# EAGLE board LT3579_SEPIC_Test_Bench (EAGLE 9.6.2)
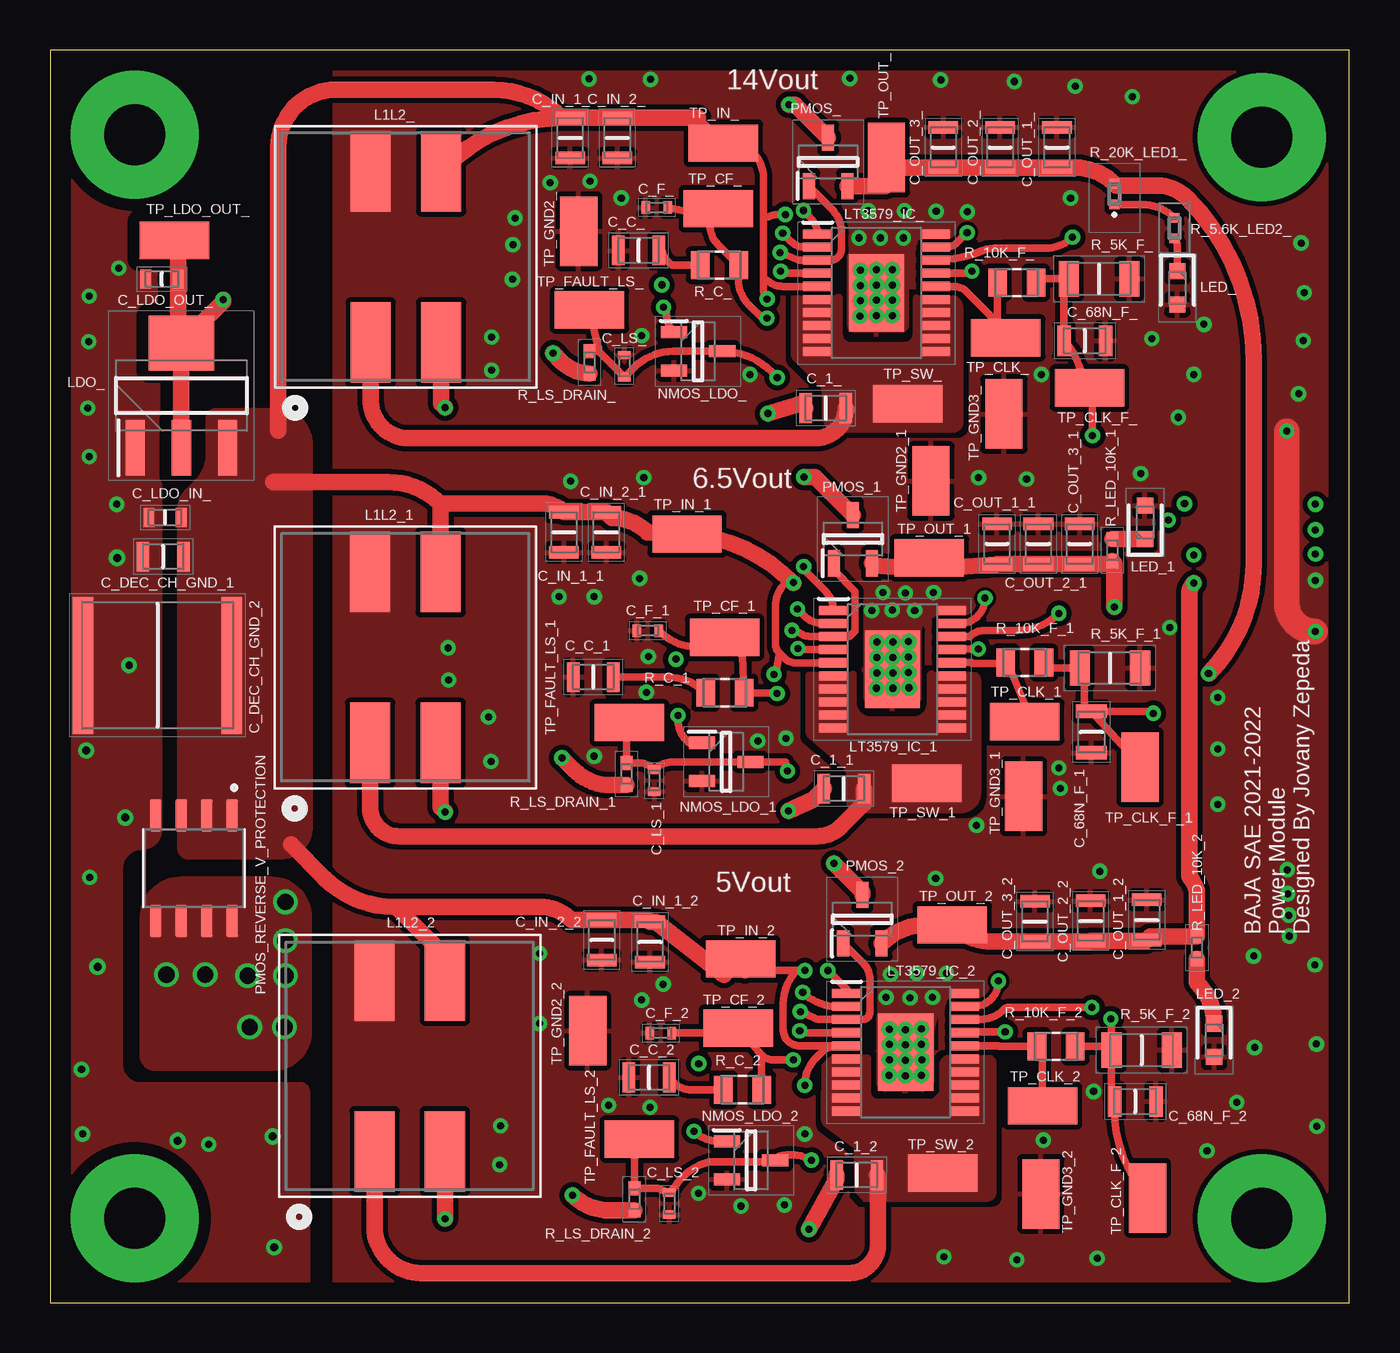
[diagram p5: board, top side]
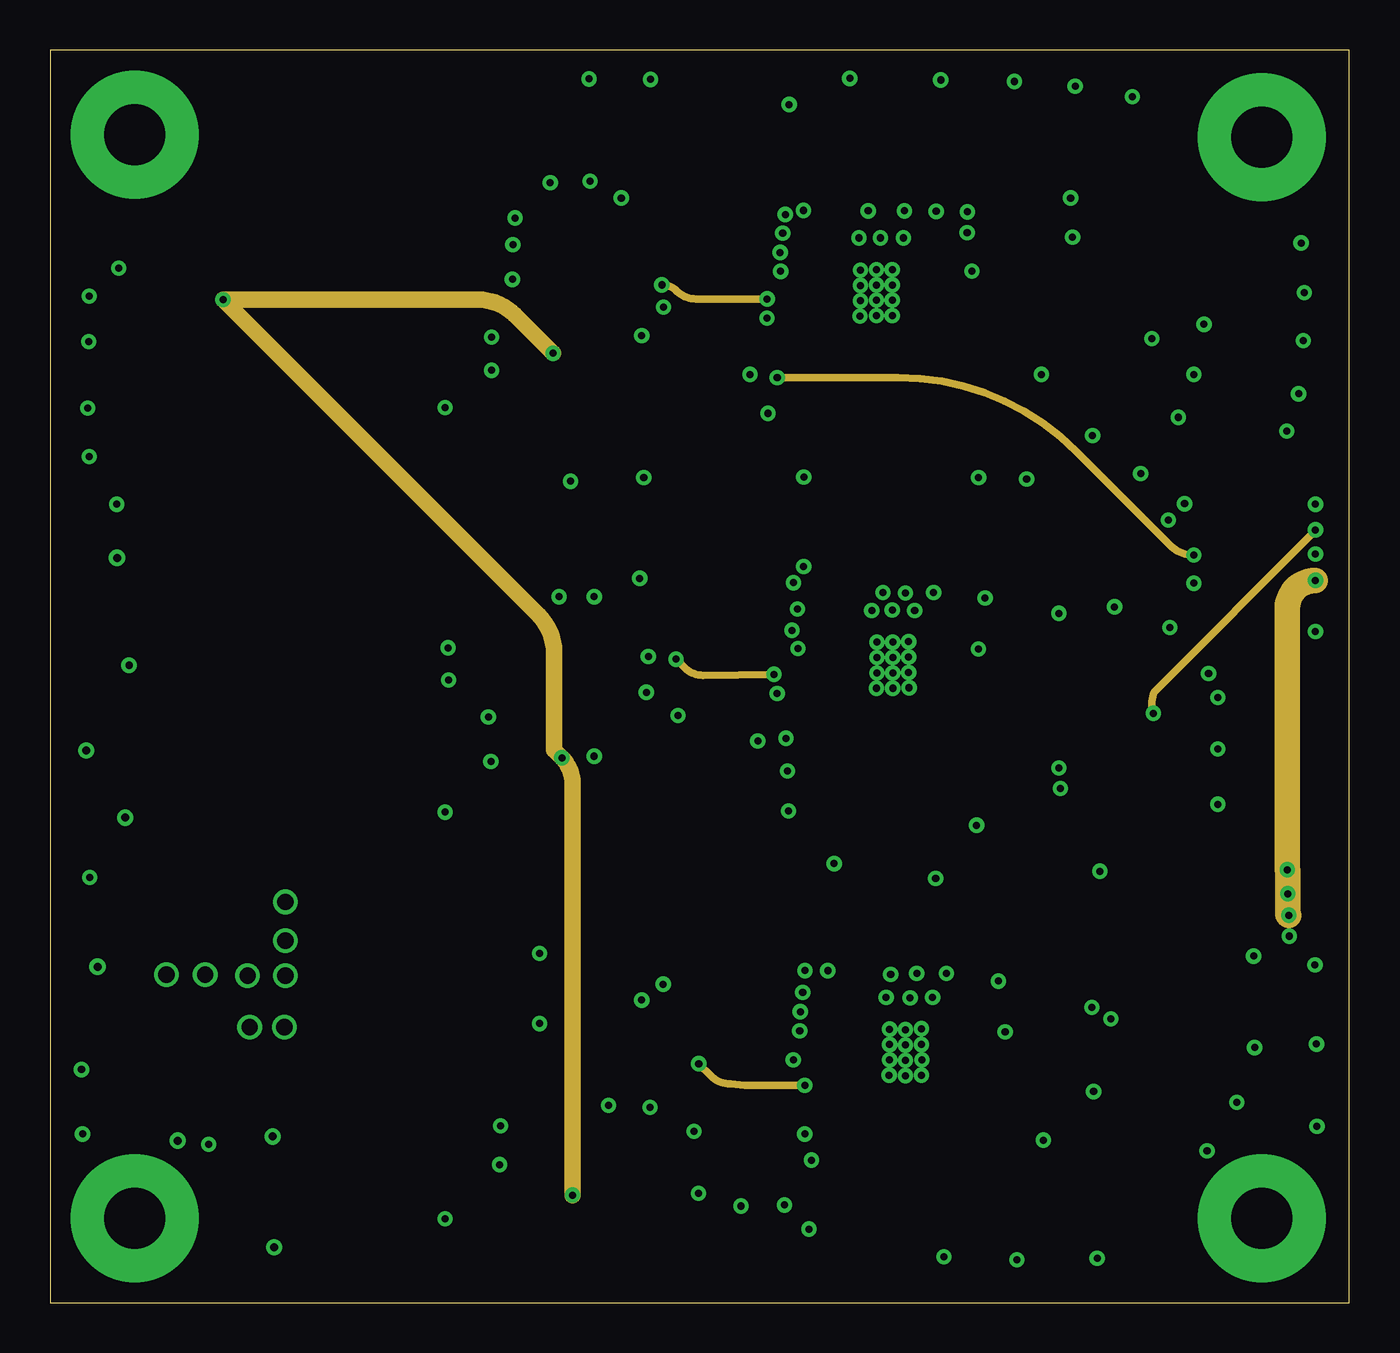
[diagram p6: board, inner layer Route2]
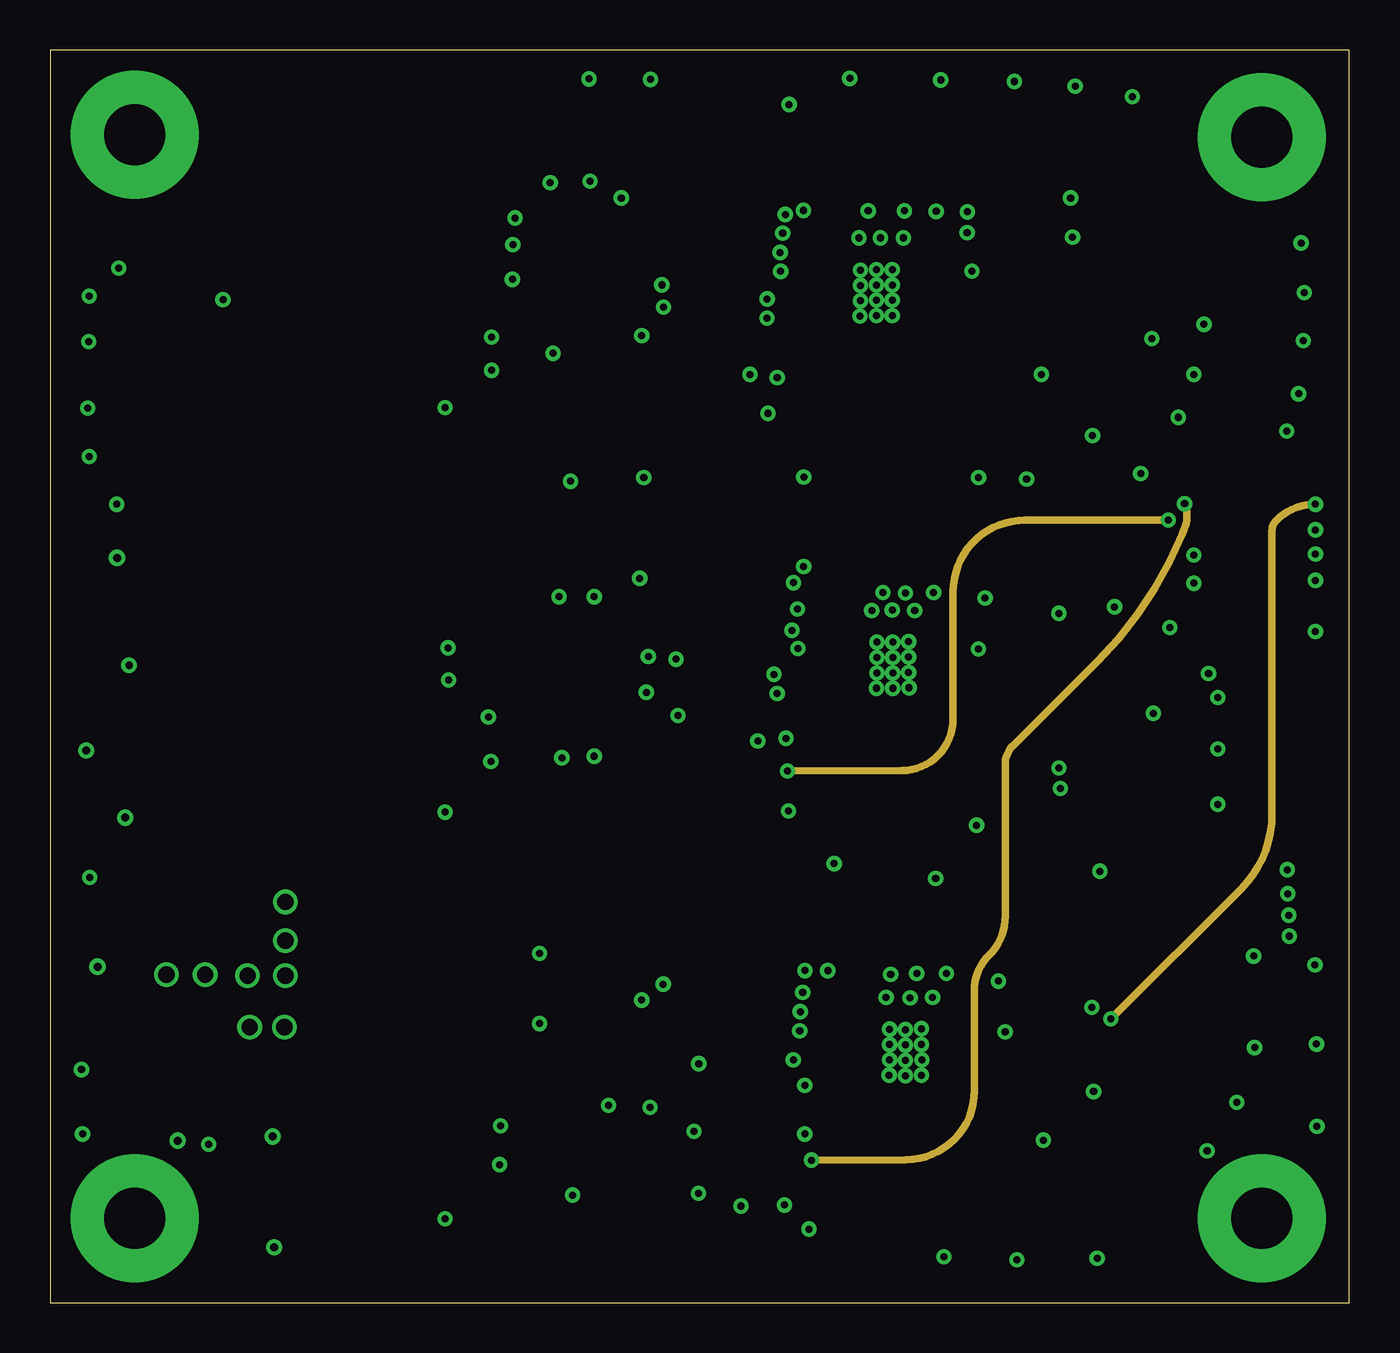
[diagram p7: board, inner layer Route15]
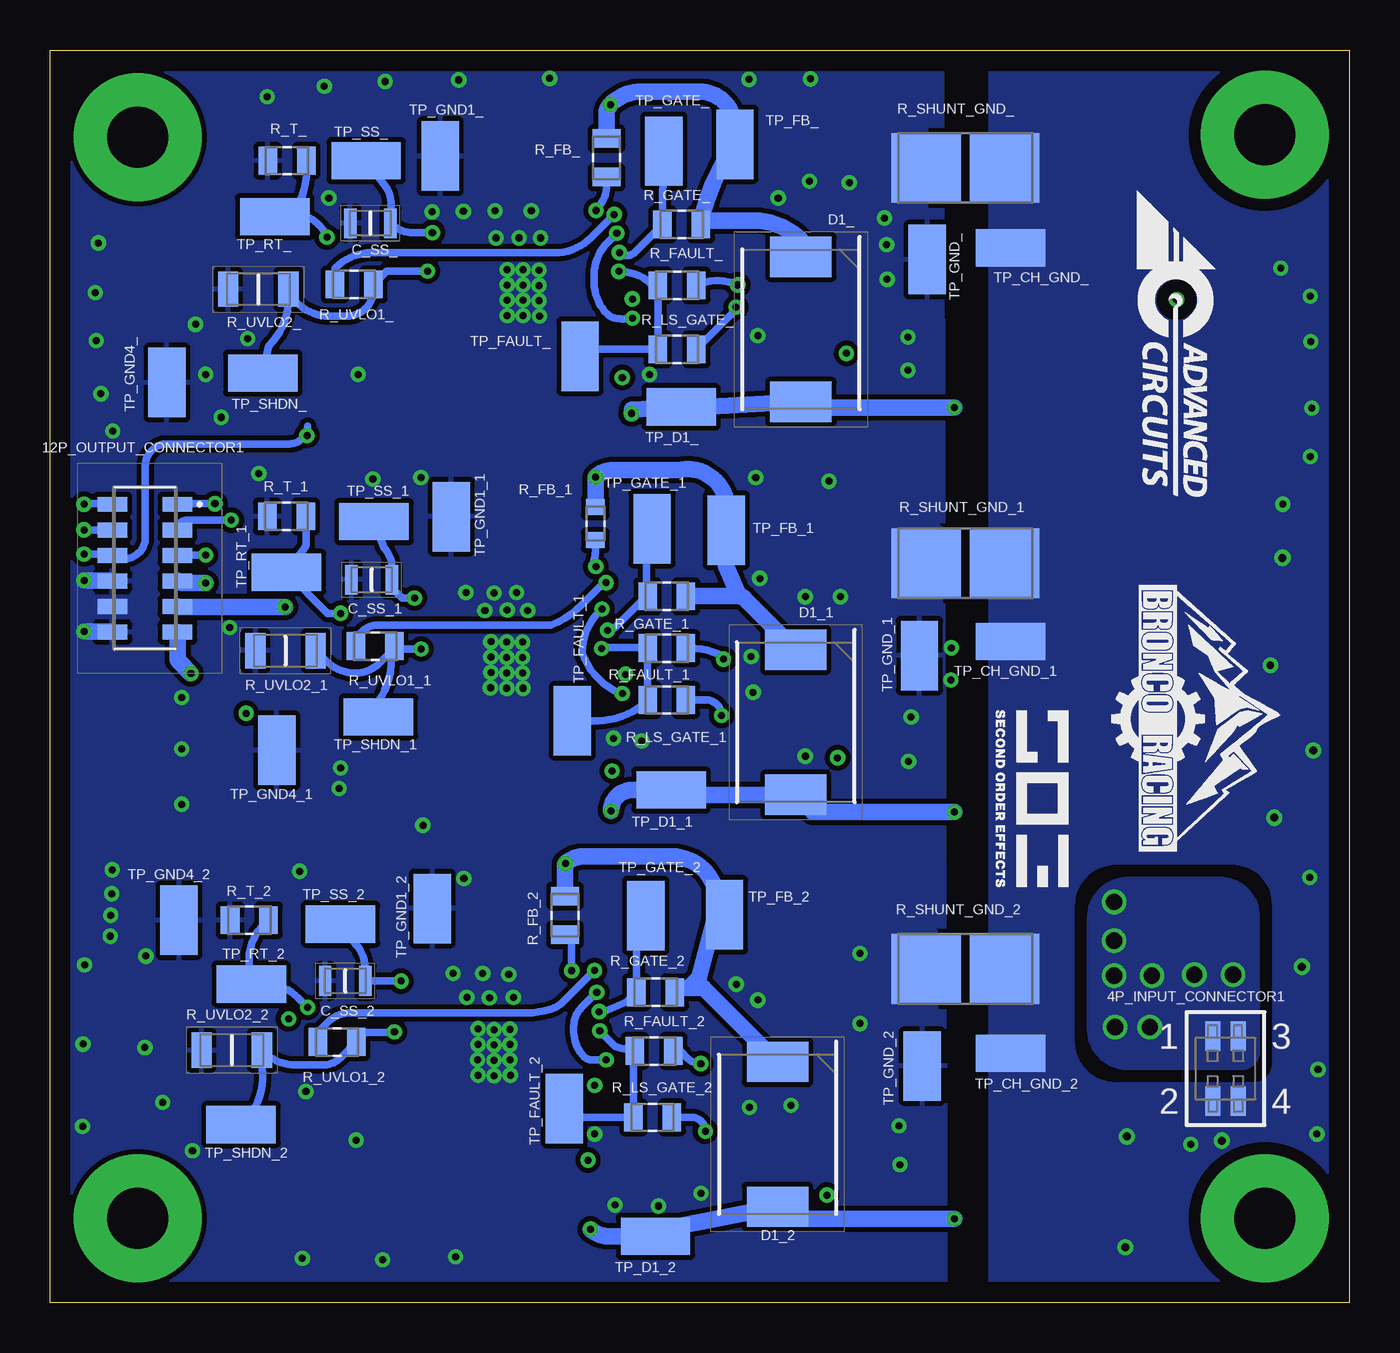
[diagram p8: board, bottom side, seen from below]

Size 64.54 x 62.23 mm. Coordinates in mm from the lower left corner, seen from the top.
Outline: 0,62.23 0,0 64.54,0 64.54,62.23 0,62.23
Copper layers (1+2*15+16): Top 0.035mm / dielectric 0.2mm / Route2 0.0175mm / dielectric 1.065mm / Route15 0.0175mm / dielectric 0.2mm / Bottom 0.035mm
Design rules "default *": minimum track width 15mil, minimum drill 0.35mm, track to track 6mil, track to pad 6mil, pad to pad 6mil, via to via 6mil, smd to smd 6mil, copper to edge 40mil, drill to drill 6mil, minimum pad ring 10mil, minimum via ring 8mil, stop-mask expansion 4mil, vias tented up to drill 40mil, thermal gap 10mil
Net classes: 1 PWR_Connector: width 3.29 mm; 2 PWR_Vin_Vout: width 0.816 mm; 3 Signal: width 0.381 mm; 4 PWR_Vin: width 0.046 mm

## Footprints (pad centres in the part's own frame; a part is rotated, then mirrored left to right if it is on the bottom)
SAMTEC-CLP-102-02-X-D = smd 0.74 x 1.47: 1 -0.635,1.613; 2 -0.635,-1.613; 3 0.635,1.613; 4 0.635,-1.613
CLP-106-02-XXX = smd 0.74 x 1.47: 1 3.175,-1.615; 2 3.175,1.615; 3 1.905,-1.615; 4 1.905,1.615; 5 0.635,-1.615; 6 0.635,1.615; 7 -0.635,-1.615; 8 -0.635,1.615; 9 -1.905,-1.615; 10 -1.905,1.615; 11 -3.175,-1.615; 12 -3.175,1.615
CAPC2012X145N = smd 0.62 x 1.47: 1 -1,0; 2 1,0
CAPC2013X150N = smd 0.67 x 1.52: 1 -1.03,0; 2 1.03,0
CAPC2012X100N = smd 0.62 x 1.47: 1 -1,0; 2 1,0
CAPC7563X250N = smd 1.01 x 6.81: 1 -3.7,0; 2 3.7,0
CAPC1005X55N = smd 0.42 x 0.62: 1 -0.55,0; 2 0.55,0
CAPC1608X90N = smd 0.54 x 0.94: 1 -0.8,0; 2 0.8,0
DIOM7958X256N = smd 2 x 3.05: 1 -3.6,0; 2 3.6,0
MSD1278T-822MLXX = smd 2 x 4: 1 1.75,4.25; 2 -1.75,4.25; 3 -1.75,-4.25; 4 1.75,-4.25
SOT230P700X180-4N = smd 2.75 x 0.95: 1 -2.6,2.3; 2 -2.6,0; 3 -2.6,-2.3 | smd 2.75 x 3.25: 4 2.6,0
APT1608CGCK = smd 0.8 x 0.8: 1 -0.825,0; 2 0.825,0
SOP65P640X120-21N = smd 1.45 x 0.45: 1 -2.925,2.925; 2 -2.925,2.275; 3 -2.925,1.625; 4 -2.925,0.975; 5 -2.925,0.325; 6 -2.925,-0.325; 7 -2.925,-0.975; 8 -2.925,-1.625; 9 -2.925,-2.275; 10 -2.925,-2.925; 11 2.925,-2.925; 12 2.925,-2.275; 13 2.925,-1.625; 14 2.925,-0.975; 15 2.925,-0.325; 16 2.925,0.325; 17 2.925,0.975; 18 2.925,1.625; 19 2.925,2.275; 20 2.925,2.925 | smd 2.74 x 3.86: 21 0,0
SOT95P280X100-3N = smd 1.3 x 0.6: 1 -1.2,0.95; 2 -1.2,-0.95; 3 1.2,0
SOIC127P600X170-8N = smd 1.58 x 0.59: 1 -2.625,1.905; 2 -2.625,0.635; 3 -2.625,-0.635; 4 -2.625,-1.905; 5 2.625,-1.905; 6 2.625,-0.635; 7 2.625,0.635; 8 2.625,1.905
ERA2AED122X = smd 0.475 x 0.5: 1 -0.512,0; 2 0.512,0
RESC3116X65N = smd 1 x 1.75: 1 -1.5,0; 2 1.5,0
RESC2012X60N = smd 0.92 x 1.38: 1 -0.955,0; 2 0.955,0
ERJ2R_(0402) = smd 0.475 x 0.5: 1 -0.512,0; 2 0.512,0
RESC1608X55N = smd 0.79 x 0.93: 1 -0.82,0; 2 0.82,0
RESC1005X37N = smd 0.7 x 0.6: 1 -0.55,0; 2 0.55,0
RESC6432X55N = smd 3.45 x 3.46: 1 -1.956,0; 2 1.956,0
S1751-46R_ = smd 3.45 x 1.85: 1 0,0
THROUGH_HOLE = drill 3.048 pad 6.35: THROUGH_HOLE 0,0

## Placement (x,y rotation side)
4P_INPUT_CONNECTOR1  SAMTEC-CLP-102-02-X-DJ  [SAMTEC-CLP-102-02-X-D]  6.15,11.63 0 bottom
12P_OUTPUT_CONNECTOR1  CLP-106-02-F-D  [CLP-106-02-XXX]  59.84,36.49 90 bottom
C_1_  CGA4J1X7R1E475K125AE  [CAPC2012X145N]  38.53,44.45 180 top
C_1_1  CGA4J1X7R1E475K125AE  [CAPC2012X145N]  39.43,25.54 180 top
C_1_2  CGA4J1X7R1E475K125AE  [CAPC2012X145N]  40.08,6.35 180 top
C_68N_F_  CEU4J2X7R1H683K125AE  [CAPC2013X150N]  51.4,47.8 0 top
C_68N_F_1  CEU4J2X7R1H683K125AE  [CAPC2013X150N]  51.73,28.35 270 top
C_68N_F_2  CEU4J2X7R1H683K125AE  [CAPC2013X150N]  53.91,10 0 top
C_C_  CGA4F4C0G2W222J085AE  [CAPC2012X100N]  29.23,52.28 180 top
C_C_1  CGA4F4C0G2W222J085AE  [CAPC2012X100N]  26.98,31.09 180 top
C_C_2  CGA4F4C0G2W222J085AE  [CAPC2012X100N]  29.75,11.2 180 top
C_DEC_CH_GND_1  CGA4F4C0G2W222J085AE  [CAPC2012X100N]  5.61,37.07 0 top
C_DEC_CH_GND_2  CGADN3X7R1E476M230LE  [CAPC7563X250N]  5.33,31.67 0 top
C_F_  CGA2B2C0G1H470J050BA  [CAPC1005X55N]  30.14,54.41 180 top
C_F_1  CGA2B2C0G1H470J050BA  [CAPC1005X55N]  29.69,33.39 180 top
C_F_2  CGA2B2C0G1H470J050BA  [CAPC1005X55N]  30.33,13.4 180 top
C_IN_1_  CGA4J1X7R1E475K125AE  [CAPC2012X145N]  25.83,57.87 270 top
C_IN_1_1  CGA4J1X7R1E475K125AE  [CAPC2012X145N]  25.52,38.28 270 top
C_IN_1_2  CGA4J1X7R1E475K125AE  [CAPC2012X145N]  29.8,17.92 270 top
C_IN_2_  CGA4J1X7R1E475K125AE  [CAPC2012X145N]  28.17,57.87 270 top
C_IN_2_1  CGA4J1X7R1E475K125AE  [CAPC2012X145N]  27.63,38.28 270 top
C_IN_2_2  CGA4J1X7R1E475K125AE  [CAPC2012X145N]  27.4,18.02 270 top
C_LDO_IN_  CGA3E1X7R1V105K080AC  [CAPC1608X90N]  5.7,39.02 180 top
C_LDO_OUT_  JMK107BB7475KA-T  [CAPC1608X90N]  5.55,50.87 180 top
C_LS_  CGA2B2C0G1H102J050BE  [CAPC1005X55N]  28.53,46.53 90 top
C_LS_1  CGA2B2C0G1H102J050BE  [CAPC1005X55N]  30.02,25.94 270 top
C_LS_2  CGA2B2C0G1H102J050BE  [CAPC1005X55N]  30.76,4.92 270 top
C_OUT_1_  CGA4J1X7R1E475K125AE  [CAPC2012X145N]  50.02,57.4 90 top
C_OUT_1_1  CGA4J1X7R1E475K125AE  [CAPC2012X145N]  47.04,37.7 90 top
C_OUT_1_2  CGA4J1X7R1E475K125AE  [CAPC2012X145N]  54.48,19.02 90 top
C_OUT_2_  CGA4J1X7R1E475K125AE  [CAPC2012X145N]  47.19,57.4 90 top
C_OUT_2_1  CGA4J1X7R1E475K125AE  [CAPC2012X145N]  49.1,37.7 90 top
C_OUT_2_2  CGA4J1X7R1E475K125AE  [CAPC2012X145N]  51.69,18.96 90 top
C_OUT_3_  CGA4J1X7R1E475K125AE  [CAPC2012X145N]  44.37,57.4 90 top
C_OUT_3_1  CGA4J1X7R1E475K125AE  [CAPC2012X145N]  51.15,37.7 90 top
C_OUT_3_2  CGA4J1X7R1E475K125AE  [CAPC2012X145N]  48.93,18.94 90 top
C_SS_  CGA4J2X8R1E224K125AE  [CAPC2012X145N]  48.63,53.64 180 bottom
C_SS_1  CGA4J2X8R1E224K125AE  [CAPC2012X145N]  48.57,35.92 180 bottom
C_SS_2  CGA4J2X8R1E224K125AE  [CAPC2012X145N]  49.88,15.99 180 bottom
D1_  MBRS330T3G  [DIOM7958X256N]  27.25,48.36 270 bottom
D1_1  MBRS330T3G  [DIOM7958X256N]  27.5,28.84 270 bottom
D1_2  MBRS330T3G  [DIOM7958X256N]  28.4,8.36 270 bottom
L1L2_  MSD1278T-XXXXX__  [MSD1278T-822MLXX]  17.67,51.96 180 top
L1L2_1  MSD1278T-XXXXX__  [MSD1278T-822MLXX]  17.64,32.06 180 top
L1L2_2  MSD1278T-XXXXX__  [MSD1278T-822MLXX]  17.86,11.76 180 top
LDO_  LDL1117S33R  [SOT230P700X180-4N]  6.51,45.08 90 top
LED_  APTD1608LCGCK  [APT1608CGCK]  56,50.43 270 top
LED_1  APTD1608LCGCK  [APT1608CGCK]  54.4,38.77 90 top
LED_2  APTD1608LCGCK  [APT1608CGCK]  57.83,13.04 270 top
LT3579_IC_  LT3579EFE#PBF  [SOP65P640X120-21N]  41.05,50.17 0 top
LT3579_IC_1  LT3579EFE#PBF  [SOP65P640X120-21N]  41.84,31.47 0 top
LT3579_IC_2  LT3579EFE#PBF  [SOP65P640X120-21N]  42.5,12.44 0 top
NMOS_LDO_  RSR025N03HZGTL  [SOT95P280X100-3N]  32.19,47.27 0 top
NMOS_LDO_1  RSR025N03HZGTL  [SOT95P280X100-3N]  33.59,26.87 0 top
NMOS_LDO_2  RSR025N03HZGTL  [SOT95P280X100-3N]  34.82,7.07 0 top
PMOS_  RQ5E050ATTCL  [SOT95P280X100-3N]  38.65,56.68 90 top
PMOS_1  RQ5E050ATTCL  [SOT95P280X100-3N]  39.88,37.94 90 top
PMOS_2  RQ5E050ATTCL  [SOT95P280X100-3N]  40.35,19.05 90 top
PMOS_REVERSE_V_PROTECTION  DMP3015LSSQ-13  [SOIC127P600X170-8N]  7.14,21.59 270 top
R_5.6K_LED2_  ERA-2ARB562X  [ERA2AED122X]  55.86,53.39 270 top
R_5K_F_  RT1206BRD075KL  [RESC3116X65N]  52.11,50.87 0 top
R_5K_F_1  RT1206BRD075KL  [RESC3116X65N]  52.65,31.53 0 top
R_5K_F_2  RT1206BRD075KL  [RESC3116X65N]  54.23,12.55 0 top
R_10K_F_  AC0805DR-0710KL  [RESC2012X60N]  48.02,50.68 0 top
R_10K_F_1  AC0805DR-0710KL  [RESC2012X60N]  48.42,31.81 0 top
R_10K_F_2  AC0805DR-0710KL  [RESC2012X60N]  49.98,12.73 0 top
R_20K_LED1_  ERJ-2RKF2002X  [ERJ2R_(0402)]  52.88,55.08 90 top
R_C_  AC0805JR-0712KL  [RESC2012X60N]  33.24,51.56 180 top
R_C_1  AC0805JR-0712KL  [RESC2012X60N]  33.52,30.3 180 top
R_C_2  AC0805JR-0712KL  [RESC2012X60N]  34.4,10.58 180 top
R_FAULT_  AT0805FRE07100KL  [RESC2012X60N]  33.39,50.55 0 bottom
R_FAULT_1  AT0805FRE07100KL  [RESC2012X60N]  33.91,32.53 0 bottom
R_FAULT_2  AT0805FRE07100KL  [RESC2012X60N]  34.54,12.51 0 bottom
R_FB_  AC0805FR-07150KL  [RESC2012X60N]  36.9,56.89 270 bottom
R_FB_1  AC0603FR-0764K9L  [RESC1608X55N]  37.46,38.71 270 bottom
R_FB_2  AC0805FR-0745K3L  [RESC2012X60N]  38.96,19.25 270 bottom
R_GATE_  AC0805FR-0710KL  [RESC2012X60N]  33.17,53.58 180 bottom
R_GATE_1  AC0805FR-0710KL  [RESC2012X60N]  33.91,35.1 180 bottom
R_GATE_2  AC0805FR-0710KL  [RESC2012X60N]  34.46,15.42 180 bottom
R_LED_10K_1  MCS0402MD1002DE000  [RESC1005X37N]  52.78,37.39 90 top
R_LED_10K_2  MCS0402MD1002DE000  [RESC1005X37N]  56.98,17.64 270 top
R_LS_DRAIN_  MCS0402MD1002DE000  [RESC1005X37N]  26.8,46.72 270 top
R_LS_DRAIN_1  MCS0402MD1002DE000  [RESC1005X37N]  28.63,26.27 270 top
R_LS_DRAIN_2  MCS0402MD1002DE000  [RESC1005X37N]  29.02,5.14 270 top
R_LS_GATE_  AT0805FRE07100KL  [RESC2012X60N]  33.4,47.37 0 bottom
R_LS_GATE_1  AT0805FRE07100KL  [RESC2012X60N]  33.91,29.95 0 bottom
R_LS_GATE_2  AT0805FRE07100KL  [RESC2012X60N]  34.61,9.21 0 bottom
R_SHUNT_GND_  GMR100HTCFAR100  [RESC6432X55N]  19.07,56.38 180 bottom
R_SHUNT_GND_1  GMR100HTCFAR100  [RESC6432X55N]  19.07,36.73 180 bottom
R_SHUNT_GND_2  GMR100HTCFAR100  [RESC6432X55N]  19.07,16.58 180 bottom
R_T_  AC0805FR-07124KL  [RESC2012X60N]  52.78,56.75 180 bottom
R_T_1  AC0805FR-07124KL  [RESC2012X60N]  52.81,39.07 180 bottom
R_T_2  AC0805FR-07124KL  [RESC2012X60N]  54.65,19.01 180 bottom
R_UVLO1_  AC0805FR-0730KL  [RESC2012X60N]  49.44,50.6 180 bottom
R_UVLO1_1  AC0805FR-0730KL  [RESC2012X60N]  48.39,32.62 180 bottom
R_UVLO1_2  AC0805FR-0730KL  [RESC2012X60N]  50.29,12.95 180 bottom
R_UVLO2_  RT1206BRD075KL  [RESC3116X65N]  54.21,50.36 0 bottom
R_UVLO2_1  RT1206BRD075KL  [RESC3116X65N]  52.85,32.4 0 bottom
R_UVLO2_2  RT1206BRD075KL  [RESC3116X65N]  55.53,12.55 0 bottom
TP_CF_  S1751-46R  [S1751-46R_]  33.19,54.36 180 top
TP_CF_1  S1751-46R  [S1751-46R_]  33.51,33.07 180 top
TP_CF_2  S1751-46R  [S1751-46R_]  34.19,13.64 180 top
TP_CH_GND_  S1751-46R  [S1751-46R_]  16.83,52.41 0 bottom
TP_CH_GND_1  S1751-46R  [S1751-46R_]  16.83,32.85 0 bottom
TP_CH_GND_2  S1751-46R  [S1751-46R_]  16.83,12.39 0 bottom
TP_CLK_  S1751-46R  [S1751-46R_]  47.47,47.94 180 top
TP_CLK_1  S1751-46R  [S1751-46R_]  48.43,28.87 0 top
TP_CLK_2  S1751-46R  [S1751-46R_]  49.3,9.78 180 top
TP_CLK_F_  S1751-46R  [S1751-46R_]  51.64,45.45 0 top
TP_CLK_F_1  S1751-46R  [S1751-46R_]  54.15,26.61 270 top
TP_CLK_F_2  S1751-46R  [S1751-46R_]  54.53,5.21 270 top
TP_D1_  S1751-46R  [S1751-46R_]  33.19,44.51 0 bottom
TP_D1_1  S1751-46R  [S1751-46R_]  33.69,25.47 0 bottom
TP_D1_2  S1751-46R  [S1751-46R_]  34.47,3.3 0 bottom
TP_FAULT_  S1751-46R  [S1751-46R_]  38.22,47.03 270 bottom
TP_FAULT_1  S1751-46R  [S1751-46R_]  38.6,28.92 270 bottom
TP_FAULT_2  S1751-46R  [S1751-46R_]  39,9.65 90 bottom
TP_FAULT_LS_  S1751-46R  [S1751-46R_]  26.79,49.33 0 top
TP_FAULT_LS_1  S1751-46R  [S1751-46R_]  28.77,28.82 180 top
TP_FAULT_LS_2  S1751-46R  [S1751-46R_]  29.27,8.12 180 top
TP_FB_  S1751-46R  [S1751-46R_]  30.52,57.56 270 bottom
TP_FB_1  S1751-46R  [S1751-46R_]  30.96,38.39 270 bottom
TP_FB_2  S1751-46R  [S1751-46R_]  31.04,19.27 90 bottom
TP_GATE_  S1751-46R  [S1751-46R_]  34.06,57.22 90 bottom
TP_GATE_1  S1751-46R  [S1751-46R_]  34.65,38.46 270 bottom
TP_GATE_2  S1751-46R  [S1751-46R_]  34.96,19.23 90 bottom
TP_GND1_  S1751-46R  [S1751-46R_]  45.16,56.98 270 bottom
TP_GND1_1  S1751-46R  [S1751-46R_]  44.62,39.06 90 bottom
TP_GND1_2  S1751-46R  [S1751-46R_]  45.55,19.58 90 bottom
TP_GND2_  S1751-46R  [S1751-46R_]  26.26,53.24 90 top
TP_GND2_1  S1751-46R  [S1751-46R_]  43.76,40.83 90 top
TP_GND2_2  S1751-46R  [S1751-46R_]  26.7,13.52 270 top
TP_GND3_  S1751-46R  [S1751-46R_]  47.38,44.16 90 top
TP_GND3_1  S1751-46R  [S1751-46R_]  48.36,25.16 90 top
TP_GND3_2  S1751-46R  [S1751-46R_]  49.22,5.4 90 top
TP_GND4_  S1751-46R  [S1751-46R_]  58.75,45.73 90 bottom
TP_GND4_1  S1751-46R  [S1751-46R_]  53.29,27.44 90 bottom
TP_GND4_2  S1751-46R  [S1751-46R_]  58.15,19.01 90 bottom
TP_GND_  S1751-46R  [S1751-46R_]  20.97,51.84 270 bottom
TP_GND_1  S1751-46R  [S1751-46R_]  21.36,32.15 270 bottom
TP_GND_2  S1751-46R  [S1751-46R_]  21.22,11.76 270 bottom
TP_IN_  S1751-46R  [S1751-46R_]  33.45,57.61 0 top
TP_IN_1  S1751-46R  [S1751-46R_]  31.64,38.19 0 top
TP_IN_2  S1751-46R  [S1751-46R_]  34.31,17.09 0 top
TP_LDO_OUT_  S1751-46R  [S1751-46R_]  6.16,52.78 180 top
TP_OUT_  S1751-46R  [S1751-46R_]  41.55,56.9 270 top
TP_OUT_1  S1751-46R  [S1751-46R_]  43.67,37.02 0 top
TP_OUT_2  S1751-46R  [S1751-46R_]  44.82,18.77 180 top
TP_RT_  S1751-46R  [S1751-46R_]  53.39,53.96 0 bottom
TP_RT_1  S1751-46R  [S1751-46R_]  52.81,36.29 180 bottom
TP_RT_2  S1751-46R  [S1751-46R_]  54.55,15.83 0 bottom
TP_SHDN_  S1751-46R  [S1751-46R_]  53.99,46.19 0 bottom
TP_SHDN_1  S1751-46R  [S1751-46R_]  48.24,29.1 0 bottom
TP_SHDN_2  S1751-46R  [S1751-46R_]  55.07,8.85 0 bottom
TP_SS_  S1751-46R  [S1751-46R_]  48.85,56.75 180 bottom
TP_SS_1  S1751-46R  [S1751-46R_]  48.46,38.82 180 bottom
TP_SS_2  S1751-46R  [S1751-46R_]  50.12,18.81 180 bottom
TP_SW_  S1751-46R  [S1751-46R_]  42.6,44.67 0 top
TP_SW_1  S1751-46R  [S1751-46R_]  43.54,25.81 180 top
TP_SW_2  S1751-46R  [S1751-46R_]  44.34,6.43 180 top
U$1  THROUGH_HOLE_  [THROUGH_HOLE]  4.19,4.19 0 top
U$2  THROUGH_HOLE_  [THROUGH_HOLE]  60.2,4.19 0 top
U$3  THROUGH_HOLE_  [THROUGH_HOLE]  60.2,57.91 0 top
U$4  THROUGH_HOLE_  [THROUGH_HOLE]  4.19,58.04 180 top

## Tracks (layer width: path | path; a pad name or v marks a point on that pad's centre or on a via)
CH_GND  (via drill 0.35, 0.4)
  other vias: 11.13,2.75 11.05,8.25 6.33,8.05 2.35,16.69 3.73,24.1 1.78,27.43 3.31,37.01 3.91,31.67 1.96,21.13 3.3,39.67 1.93,42.04 1.85,44.45 1.91,47.75 3.4,51.41 1.93,50.01 1.55,11.58 1.6,8.38 7.87,7.87
  pour Bottom (isolate 0.61, rank 2, no thermals): 17.88,62.36 -0.25,62.36 -0.25,-0.13 17.88,-0.13
  pour Top (isolate 0.61, no thermals): 12.88,-0.3 -0.23,-0.3 -0.23,62.38 12.98,62.38 12.98,45.83 arc-90 12.03,44.88 7.65,44.88 arc90 6.96,44.19 6.96,42.61 arc-90 6.06,41.71 arc90 5.54,41.18 5.54,23.52 arc-90 4.55,22.53 arc90 3.58,21.56 3.58,11.83 arc90 4.49,10.92 12.45,10.92 arc-90 12.88,10.49
  pour Bottom (no thermals): 17.04,58.83 17.04,54.25 16.89,54.1 14.83,54.1 14.66,54.28 14.66,58.42 14.88,58.65 15.06,58.83
  pour Bottom (no thermals): 17.14,38.94 17.14,34.77 16.97,34.59 15.21,34.59 15.11,34.7 15.04,34.77 15.04,38.81 15.34,39.12 16.92,39.12 16.99,39.12 17.14,38.96
  pour Bottom (no thermals): 16.74,18.52 16.99,18.26 16.99,14.63 16.87,14.5 15.06,14.5 14.88,14.68 14.88,18.41 14.99,18.52
CLK_
  Top 0.381: R_10K_F_.1 47.07,48.7 46.92,48.85 | TP_CLK_.1 46.92,48.85 | LT3579_IC_.16 44.89,50.5 arc-45 45.53,50.23 46.92,48.85
CLK_1
  Top 0.381: TP_CLK_1.1 48.42,29.73 47.64,31.63 R_10K_F_1.1 47.41,31.76 45.82,31.76 45.78,31.8 LT3579_IC_1.16
CLK_2
  Top 0.381: LT3579_IC_2.16 47.05,12.77 arc-45 47.15,12.73 47.74,12.73 47.75,12.73 R_10K_F_2.1 49.3,12.46 TP_CLK_2.1
CLK_FILTER_OUT_  (via drill 0.35)
  Top 0.381: v51.79,43.09 51.79,45.31 TP_CLK_F_.1 51.3,45.44 arc45 C_68N_F_.1 50.37,50.63 R_5K_F_.1 49.17,50.87 R_10K_F_.2
  Bottom 0.381: v62.87,37.2 61.52,37.2 12P_OUTPUT_CONNECTOR1.6 61.45,36.96 60.89,36.96 arc-90 59.82,38.03 59.82,41.6 arc90 58.74,42.67 52.66,42.67 arc-90 51.76,43.57 v51.79,43.09
CLK_FILTER_OUT_1  (via drill 0.35)
  Top 0.381: R_10K_F_1.2 49.65,31.53 R_5K_F_1.1 51.38,31.31 51.38,29.31 C_68N_F_1.1 | C_68N_F_1.1 54.01,26.88 TP_CLK_F_1.1 | v54.81,29.29 54.72,29.38 C_68N_F_1.1
  Route2 0.381: v62.87,38.4 62.87,38.36 54.86,30.35 arc45 v54.81,29.29
  Bottom 0.381: v62.87,38.4 12P_OUTPUT_CONNECTOR1.4 | 12P_OUTPUT_CONNECTOR1.4
CLK_FILTER_OUT_2  (via drill 0.35)
  Top 0.381: R_5K_F_2.1 52.55,12.73 R_10K_F_2.2 | R_5K_F_2.1 52.73,10.14 C_68N_F_2.1 52.88,9.63 arc41 TP_CLK_F_2.1 | R_5K_F_2.1 52.73,14.03 arc45 v52.7,14.1
  Route15 0.381: v52.7,14.1 59.18,20.57 arc45 60.71,24.26 60.71,38.36 arc-45 60.91,38.87 arc-45 v62.87,39.67
  Bottom 0.381: v62.87,39.67 62.84,39.7 61.48,39.7 12P_OUTPUT_CONNECTOR1.2
FAULT_  (via drill 0.35)
  Top 0.381: LT3579_IC_.4 36.39,51.15 v36.29,51.25
  Bottom 0.381: TP_FAULT_.1 37.82,47.03 37.48,47.37 R_LS_GATE_.1 R_FAULT_.1 34.6,50.55 arc-45 v36.29,51.25
FAULT_1  (via drill 0.35)
  Top 0.381: LT3579_IC_1.4 37.21,32.45 v37.16,32.5
  Bottom 0.381: v37.16,32.5 37.11,32.55 34.89,32.55 R_FAULT_1.1 R_LS_GATE_1.1 arc45 37.36,28.92 TP_FAULT_1.1
FAULT_2  (via drill 0.35)
  Top 0.381: LT3579_IC_2.4 37.32,13.42 v37.24,13.5
  Bottom 0.381: v37.24,13.5 36.48,12.74 arc-22 35.66,12.58 35.6,12.51 R_FAULT_2.1 35.57,12.43 R_LS_GATE_2.1 38.56,9.21 TP_FAULT_2.1
FAULT_LS_OUT_  (via drill 0.35)
  Top 0.381: TP_FAULT_LS_.1 27.23,47.39 26.72,47.35 R_LS_DRAIN_.1 27.24,47.27 C_LS_.1 29.01,46.46 arc-45 30.96,47.27 NMOS_LDO_.3 arc-45 35.84,46.26 v36.12,45.97
  Route2 0.381: v36.12,45.97 42.11,45.97 arc-45 50.99,42.3 55.7,37.58 arc45 56.75,37.15 v56.82,37.15
  Bottom 0.381: v56.82,37.15 58.21,37.15 12P_OUTPUT_CONNECTOR1.5
FAULT_LS_OUT_1  (via drill 0.35)
  Top 0.381: TP_FAULT_LS_1.1 28.63,28.53 R_LS_DRAIN_1.1 29.22,26.82 arc-45 C_LS_1.1 arc-45 30.93,26.87 NMOS_LDO_1.3 36.53,26.87 v36.63,26.42
  Route15 0.381: v36.63,26.42 42.3,26.44 arc90 44.86,29 44.86,35.31 arc-90 48.43,38.88 v55.55,38.88
  Bottom 0.381: 12P_OUTPUT_CONNECTOR1.3 arc90 57.74,38.88 v55.55,38.88
FAULT_LS_OUT_2  (via drill 0.35)
  Top 0.381: TP_FAULT_LS_2.1 29.02,7.35 R_LS_DRAIN_2.1 30.07,5.69 arc-45 30.59,5.47 C_LS_2.1 31.03,5.75 arc-45 32.73,7 35.94,7 NMOS_LDO_2.3 36.21,7.27 arc-45 v37.82,7.08
  Route15 0.381: v56.36,39.7 arc-45 56.36,38.46 56.25,38.19 arc-22 52.02,31.86 47.84,27.69 arc45 47.45,26.73 47.45,19.67 47.45,19.2 arc-45 46.64,17.25 arc45 45.92,15.51 45.92,10.53 arc-90 42.51,7.1 v37.82,7.08
  Bottom 0.381: v56.36,39.7 58.2,39.7 12P_OUTPUT_CONNECTOR1.1
FB_  (via drill 0.35)
  Top 0.381: v37.43,54.27 37.61,54.09 arc-23 38.12,53.32 LT3579_IC_.1
  Bottom 0.381: R_FB_.2 36.9,55.55 arc45 v37.43,54.27
FB_1  (via drill 0.35)
  Top 0.381: v37.43,36.57 37.43,36.45 38.52,35.35 arc-45 LT3579_IC_1.1
  Bottom 0.381: R_FB_1.2 37.46,37.31 arc23 37.56,36.8 37.33,36.57 v37.43,36.57
FB_2  (via drill 0.35)
  Top 0.381: LT3579_IC_2.1 39.58,15.56 v38.63,16.5
  Bottom 0.381: R_FB_2.2 38.63,18.21 v38.63,16.5
GATE_  (via drill 0.35)
  Top 0.381: PMOS_.1 38.8,54.38 arc-45 39.32,53.12 39.32,52.37 arc-90 38.75,51.8 LT3579_IC_.3 37.17,51.8 36.28,52.17 arc-45 v36.27,52.18
  Bottom 0.381: v36.27,52.18 arc-90 35.51,52.18 R_GATE_.2 34.09,57.18 TP_GATE_.1
GATE_1  (via drill 0.35)
  Top 0.381: v36.85,33.41 37.06,33.41 arc45 37.81,33.1 LT3579_IC_1.3 39.7,33.1 39.99,33.38 39.99,35.34 38.93,36.39 PMOS_1.1
  Bottom 0.381: R_GATE_1.2 34.86,35.17 34.92,35.11 | v36.85,33.41 36.84,33.4 arc-45 36.49,33.54 34.92,35.11 | TP_GATE_1.1 34.92,38.19 34.92,35.11
GATE_2  (via drill 0.35)
  Top 0.381: PMOS_2.1 40.4,16.86 arc-45 40.72,16.08 40.72,14.42 arc-90 40.37,14.07 LT3579_IC_2.3 38.4,14.07 arc-45 37.45,14.46 v37.26,14.46
  Bottom 0.381: TP_GATE_2.1 35.41,19.03 R_GATE_2.2 35.9,14.94 37.05,14.46 v37.26,14.46
GND  (via drill 0.35)
  Top 1.27: v61.44,43.31 61.44,34.77 arc90 v62.87,33.35
  Route2 1.27: v62.87,35.89 arc90 61.47,34.49 v61.47,21.51 61.49,21.49 v61.49,20.32 61.49,19.3 v61.54,19.25
  Bottom 0.816: v62.87,33.35 v62.87,33.34 61.48,33.34 12P_OUTPUT_CONNECTOR1.12 | v62.87,35.89 61.45,35.89 12P_OUTPUT_CONNECTOR1.8
  other vias: 22.96,50.85 29.82,60.78 28.37,54.89 44.25,60.76 50.93,60.45 57.33,48.62 54.74,47.9 26.77,60.81 23.09,53.9 22.99,52.58 21.92,47.98 21.92,46.33 29.39,48.06 34.77,46.13 40.18,52.91 41.25,52.91 42.39,52.91 39.73,60.83 47.9,60.68 53.77,59.92 49.25,46.13 56.06,43.99 56.82,46.13 62.03,45.16 62.26,47.8 62.31,50.19 62.15,52.65 24.84,55.65 26.82,55.73 40.64,54.25 42.44,54.25 44.02,54.23 45.57,54.2 50.7,54.89 22.38,8.79 29.39,15.04 30.45,15.82 44.4,2.29 52.02,2.21 57.48,7.54 49.35,8.08 59.84,12.67 59.79,17.22 52.15,21.44 43.99,21.08 24.31,13.87 24.31,17.35 22.33,6.86 27.74,9.8 29.79,9.7 32.21,5.44 34.32,4.8 36.47,4.85 37.49,8.38 48.03,2.13 51.84,10.49 58.95,9.96 62.94,8.76 62.92,12.85 62.84,16.79 41.53,15.16 42.72,15.14 43.84,15.16 61.57,18.21 41.76,16.31 43.05,16.36 44.53,16.36 27.03,35.08 21.77,29.11 29.62,30.33 35.15,27.91 48.51,40.92 54.18,41.2 50.19,25.55 46.02,23.72 25.86,40.82 29.49,41 46.13,41 25.27,35.08 29.29,35.99 19.76,32.54 19.79,30.94 21.89,26.9 27.03,27.15 29.72,32.11 36.55,28.04 40.82,34.39 41.83,34.42 42.95,34.39 55.63,33.55 58.01,30.07 58.01,27.51 58.01,24.77 50.11,26.57 41.38,35.28 42.49,35.26 43.89,35.28 41.07,32.82 42.65,32.84 41.86,32.82 41.07,32.05 41.07,31.29 41.05,30.53 41.86,32.05 41.86,31.29 41.86,30.53 42.65,32.08 42.65,31.32 42.67,30.56 40.26,51.31 41.83,51.33 41.05,51.33 40.26,50.55 40.26,49.78 40.23,49.02 41.05,50.57 41.05,49.81 41.05,49.05 41.83,50.57 41.83,49.81 41.83,49.05 41.71,13.59 43.28,13.61 42.49,13.56 41.71,12.83 41.71,12.06 41.68,11.3 42.49,12.8 42.49,12.04 42.49,11.28 43.28,12.83 43.31,12.06 43.28,11.3
  pour Bottom (isolate 0.25): 20.21,62.37 20.05,-0.48 65.31,-0.48 65.48,62.37
  pour Top (isolate 0.25, rank 2): 14.07,62.38 65.7,62.38 65.13,-0.58 14.07,-0.58
  pour Top (no thermals): 15.27,58.42 14.76,58.42 14.66,58.32 14.66,54 14.78,53.87 17.27,53.87 17.32,53.92 17.32,58.24 17.2,58.37 17.14,58.42
  pour Bottom (no thermals): 21.11,58.85 21.11,54.31 21.23,54.18 23.22,54.18 23.29,54.25 23.29,58.67 23.24,58.72 23.09,58.88 23.06,58.85
  pour Top (no thermals): 39.62,48.63 39.62,53.9 arc-90 40.49,54.76 47.37,54.76 arc-90 47.45,54.69 47.45,53.12 arc-90 47.18,52.86 43.35,52.86 arc45 43.23,52.81 42.61,52.19 42.61,48.55 arc-90 42.29,48.23 40.02,48.23 arc-90
  pour Top (no thermals): 16.03,18.34 14.86,18.34 14.63,18.11 14.63,13.74 14.99,13.39 17.45,13.39 17.75,13.69 17.75,17.68 17.5,17.93 17.09,18.34
  pour Bottom (no thermals): 20.47,18.44 20.6,18.57 22.94,18.57 23.09,18.41 23.09,14.5 23.01,14.43 20.6,14.43 20.47,14.55
  pour Top (no thermals): 43.87,11.3 43.87,11.07 arc-90 43.31,10.52 41.53,10.52 arc-90 41.1,10.95 41.1,16.35 arc-90 41.69,16.94 47.21,16.94 arc-90 47.68,16.47 47.68,15.49 arc-90 47.29,15.11 44.74,15.11 arc45 44.68,15.09 44.61,15.02 arc45 43.87,13.22
  pour Top (no thermals): 15.21,39.07 14.53,38.38 14.53,37.72 14.53,34.14 14.78,33.88 17.12,33.88 17.27,34.04 17.45,34.21 17.45,38.51 16.89,39.07
  pour Bottom (no thermals): 60.38,35.1 60.4,35.13 62.56,35.13 62.64,35.05 62.64,34.01 60.5,34.01 60.38,34.14
  pour Bottom (no thermals): 20.75,39.01 20.24,38.51 20.24,34.59 20.37,34.47 23.22,34.47 23.42,34.67 23.42,38.86 23.27,39.01
  pour Top (no thermals): 47.07,34.62 arc-90 46.5,34.06 43.96,34.06 arc90 43.24,33.34 43.24,30.1 arc-90 42.83,29.69 40.86,29.69 arc-90 40.46,30.08 40.46,34.81 arc-90 41.41,35.76 46.91,35.76 arc-90
LDO_OUT_  (via drill 0.35)
  Top 0.816: LDO_.2 6.51,47.18 | 6.51,47.18 LDO_.4 8.59,49.75 v8.59,49.84 v8.58,49.84 | v24.98,47.17 25.41,46.75 arc45 R_LS_DRAIN_.2 | v25.42,27.07 26.02,26.47 arc45 27.82,25.72 R_LS_DRAIN_1.2 | R_LS_DRAIN_2.2 27.77,4.59 arc-45 v25.95,5.34 | TP_LDO_OUT_.1 6.35,52.6 C_LDO_OUT_.1 6.35,47.35 6.51,47.18
  Route2 0.816: v25.95,5.34 25.95,25.8 arc45 v25.42,27.07 25.03,27.46 25.03,32.34 arc45 24.29,34.14 v8.58,49.84 21.27,49.84 arc-45 23.06,49.1 v24.98,47.17
N$1  (via drill 0.35)
  Top 0.816: L1L2_1.2 19.39,24.6 v19.62,24.37 | v36.68,24.44 37.86,24.97 C_1_1.2
  Bottom 0.816: v19.62,24.37 26.64,24.37 D1_1.2 33.69,25.24 TP_D1_1.1 35.65,25.47 arc-90 v36.68,24.44
N$2
  Top 0.381: C_C_1.1 30.67,31.09 arc-45 R_C_1.2
N$3  (via drill 0.35)
  Top 0.816: PMOS_1.3 38.01,41.02 v37.44,41.02
  Bottom 0.816: D1_1.1 30.05,34.99 arc-45 30.33,35.1 | 30.33,35.1 R_GATE_1.1 | 30.33,35.1 30.95,36.59 TP_FB_1.1 30.95,39.87 arc-90 33.33,41.37 36.58,41.37 arc-45 v37.44,41.02 37.46,41 R_FB_1.1
N$4
  Top 0.381: R_C_.2 30.9,51.56 arc-45 30.39,52.28 C_C_.1
N$5  (via drill 0.35)
  Top 0.816: L1L2_2.2 v19.62,4.17 | v37.7,3.65 39.08,6.13 C_1_2.2
  Bottom 0.816: v19.62,4.17 27.81,4.17 D1_2.2 34.12,3.65 TP_D1_2.1 36.83,3.29 arc45 v37.7,3.65
N$6
  Top 0.381: C_C_2.1 arc59 31.85,10.58 R_C_2.2
N$7  (via drill 0.35)
  Top 0.816: PMOS_2.3 40.35,20.42 v38.95,21.82
  Bottom 0.816: D1_2.1 32.09,15.65 32.82,15.65 | 32.82,15.65 33.45,15.65 33.51,15.6 R_GATE_2.1 | 32.82,15.65 32.32,16.15 31.53,19.06 TP_FB_2.1 31.52,20.65 arc-71 33.68,22.17 38.09,22.17 arc-45 v38.95,21.82 38.96,21.8 R_FB_2.1
N$8  (via drill 0.35)
  Top 0.381: NMOS_LDO_.1 NMOS_LDO_.1 arc-45 30.62,49.1 arc45 v30.47,49.47
  Bottom 0.381: R_LS_GATE_.2 30.47,49.35 v30.47,49.47
N$9  (via drill 0.35)
  Top 0.816: L1L2_.2 19.42,44.67 v19.62,44.47 | v35.67,44.19 37.31,44.67 C_1_.2
  Bottom 0.816: v19.62,44.47 26.96,44.47 D1_.2 33.09,44.46 TP_D1_.1 35.63,44.38 v35.67,44.19
N$10  (via drill 0.35)
  Top 0.381: NMOS_LDO_1.1 31.73,27.82 31.58,27.98 arc-45 31.18,28.93 v31.18,29.17
  Bottom 0.381: v31.18,29.17 arc-90 31.96,29.95 R_LS_GATE_1.2
N$11
  Top 0.816: R_LED_10K_1.2 LED_1.1
N$12
  Top 0.381: R_20K_LED1_.1 54.24,54.57 arc-45 R_5.6K_LED2_.1
N$13  (via drill 0.35)
  Top 0.816: PMOS_.3 36.99,59.54 v36.72,59.54
  Bottom 0.816: D1_.1 27.25,52.8 arc-45 29.59,53.77 32.02,53.77 | 32.02,53.77 32.23,53.77 32.12,54.17 arc20 TP_FB_.1 30.58,58.58 arc-87 32.26,60.17 35.18,60.17 arc-45 v36.72,59.54 arc-45 36.9,59.09 R_FB_.1 | 32.02,53.77 R_GATE_.1
N$14  (via drill 0.35)
  Top 0.381: NMOS_LDO_2.1 33.19,8.02 arc-45 v31.99,8.52
  Bottom 0.381: v31.99,8.52 arc-90 32.68,9.21 R_LS_GATE_2.2
N$15
  Top 0.381: R_5.6K_LED2_.2 arc-45 56,52.53 LED_.1
N$16
  Top 0.816: LED_2.1 arc45 56.98,15.91 R_LED_10K_2.2
RT_  (via drill 0.35)
  Top 0.381: LT3579_IC_.18 arc22 46.32,52.26 46.52,52.35 | v50.8,52.95 arc-45 49.47,52.4 47.07,52.4 arc11 46.52,52.35 | 46.52,52.35
  Bottom 0.381: R_T_.1 arc45 52.72,53.73 TP_RT_.1 51.8,53.96 arc45 v50.8,52.95
RT_1  (via drill 0.35)
  Top 0.381: v50.12,34.25 arc-45 48.06,33.4 46.42,33.4 arc45 45.69,33.1 LT3579_IC_1.18
  Bottom 0.381: R_T_1.1 51.83,37.71 arc45 51.93,37.48 TP_RT_1.1 50.77,34.25 v50.12,34.25
RT_2  (via drill 0.35)
  Top 0.381: LT3579_IC_2.18 46.17,14.07 arc45 47.39,14.57 arc-45 47.64,14.68 v51.76,14.68
  Bottom 0.381: R_T_2.1 54.09,18.62 arc-45 54.66,16.91 TP_RT_2.1 53.85,15.83 arc45 52.26,15.17 v51.76,14.68
SHDN_  (via drill 0.35)
  Top 0.381: LT3579_IC_.17 44.15,51.15 44.16,51.16 45.69,51.16 v45.8,51.26
  Bottom 0.381: TP_SHDN_.1 53.68,47.54 arc-45 52.71,49.89 52.71,50.09 | 52.71,50.09 R_UVLO2_.2 | v45.8,51.26 47.83,51.26 R_UVLO1_.1 48.49,50.33 arc90 49.8,49.02 50.69,49.02 arc45 52.31,49.69 52.71,50.09
SHDN_1  (via drill 0.35)
  Top 0.381: LT3579_IC_1.17 44.8,32.48 v46.12,32.48
  Bottom 0.381: 47.6,32.36 48.2,31.77 arc45 49.37,31.29 arc45 50.86,31.9 R_UVLO2_1.2 | 47.6,32.36 47.44,32.53 R_UVLO1_1.1 47.3,32.48 v46.12,32.48 | TP_SHDN_1.1 48.44,29.58 arc-45 47.6,32.36
SHDN_2  (via drill 0.35)
  Top 0.381: v47.45,13.45 45.46,13.45 LT3579_IC_2.17
  Bottom 0.381: TP_SHDN_2.1 54.67,9.24 arc-45 54.02,11.65 R_UVLO2_2.2 53.96,12.49 arc-45 52.32,11.8 51.03,11.8 arc-45 50.1,12.19 R_UVLO1_2.1 48.86,13.43 47.47,13.43 v47.45,13.45
SS_  (via drill 0.35)
  Top 0.381: LT3579_IC_.19 44.48,52.45 arc45 45.08,52.69 v45.56,53.17
  Bottom 0.381: TP_SS_.1 47.86,55.42 arc45 47.63,54.31 C_SS_.1 C_SS_.1 arc-45 46.52,53.17 v45.56,53.17
SS_1  (via drill 0.35)
  Top 0.381: LT3579_IC_1.19 45.19,33.75 arc90 v46.45,35.01
  Bottom 0.381: TP_SS_1.1 47.95,37.49 arc45 47.57,36.58 C_SS_1.1 47.68,35.82 47.68,35.63 47.06,35.01 v46.45,35.01
SS_2  (via drill 0.35)
  Top 0.381: LT3579_IC_2.19 45.86,14.72 arc90 v47.12,15.98
  Bottom 0.381: v47.12,15.98 48.86,15.98 arc45 C_SS_2.1 48.88,16.5 arc-45 49.48,17.94 TP_SS_2.1
SW1-2_
  Top 0.816: L1L2_.1 15.92,44.74 arc90 17.96,42.96 38.03,42.96 arc90 C_1_.1
  pour Top (isolate 0.25, no thermals): 42.92,48.19 42.92,49.88 arc-90 43.11,50.07 44.64,50.07 arc-90 45.32,49.4 45.32,43.77 arc-90 44.82,43.27 39.25,43.27 arc-90 38.39,44.13 38.39,45.34 arc45 38.33,45.48 37.02,46.8 arc-45 36.84,47.22 36.84,49.99 arc-90 36.93,50.07 39.16,50.07 arc-90 39.32,49.92 39.32,48.13 arc90 39.78,47.67 42.41,47.67 arc90
SW1-2_1
  Top 0.816: L1L2_1.1 15.89,24.61 arc90 17.32,23.17 38.11,23.17 arc45 39.29,23.66 40.43,24.8 C_1_1.1
  pour Top (isolate 0.25, no thermals): 40.79,29.07 42.88,29.07 arc90 43.6,29.8 43.6,31.14 arc-90 43.84,31.37 45.72,31.37 arc-90 46.2,30.89 46.2,25.35 arc-90 45.23,24.37 40.17,24.37 arc-90 39.6,24.94 39.6,26.18 arc50 39.38,26.66 37.74,28.06 arc-50 37.57,28.42 37.57,31.12 arc-91 37.83,31.37 39.87,31.35 arc-89 40,31.21 40,29.86 arc90
SW1-2_2
  Top 0.816: L1L2_2.1 16.11,3.78 arc90 18.41,1.47 39.72,1.47 arc90 41.12,2.87 41.12,6.3 C_1_2.1
  pour Top (isolate 0.25, no thermals): 40.42,5.07 46.52,5.07 arc90 46.97,5.53 46.97,11.86 arc90 46.56,12.27 44.71,12.27 arc90 44.22,11.79 44.22,10.47 43.82,10.07 41.12,10.07 arc-90 40.72,10.48 40.72,12.13 arc89 40.58,12.27 38.7,12.29 arc90 38.36,11.96 38.34,9.17 arc54 38.55,8.76 39.99,7.68 40.02,5.47
VC_  (via drill 0.35)
  Top 0.381: C_F_.1 31.78,54.18 TP_CF_.1 32.79,53.52 arc45 33.18,52.57 R_C_.1 34.2,50.82 arc45 34.7,49.59 35.4,48.9 v35.61,48.92 | LT3579_IC_.2 37.51,52.45 arc-45 36.79,52.75 v36.39,53.14
  Bottom 0.381: v36.39,53.14 36.86,52.68 arc-45 37.52,51.08 37.52,50.71 arc-45 36.86,49.11 arc-45 35.94,48.9 v35.61,48.92
VC_1  (via drill 0.35)
  Top 0.381: C_F_1.1 30.31,33.33 arc45 32.1,32.58 TP_CF_1.1 34.39,32.13 R_C_1.1 36.09,30.3 v36.12,30.27 | LT3579_IC_1.2 38.35,33.75 arc-45 37.51,34.1 v37.13,34.47
  Bottom 0.381: v37.13,34.47 37.27,34.33 arc-45 38.12,32.29 arc-45 36.27,30.27 v36.12,30.27
VC_2  (via drill 0.35)
  Top 0.381: 35.34,12.31 TP_CF_2.1 33.95,13.4 C_F_2.1 | 35.34,12.31 R_C_2.1 | v36.92,12.06 35.95,12.06 arc-45 35.34,12.31 | LT3579_IC_2.2 39.08,14.72 arc-45 v37.39,15.42
  Bottom 0.381: v37.39,15.42 38.15,14.66 arc-45 38.53,13.73 38.53,13.46 arc-45 38.02,12.22 arc-45 37.63,12.06 v36.92,12.06
VIN  (via drill 0.35)
  Top 0.381: 35.44,53.92 35.44,55.9 arc90 33.73,57.61 TP_IN_.1 32.19,58.87 | 35.44,53.92 35.44,50.97 | 35.44,50.97 35.57,50.84 arc45 36.41,50.5 LT3579_IC_.5 | 36.23,32.27 arc-45 36.03,32.76 36.03,34.59 arc-45 36.52,35.76 36.92,35.76 v36.93,35.77 | 36.23,32.27 36.47,32.03 arc45 37.1,31.77 38.89,31.77 LT3579_IC_1.5 | 37.1,16.5 arc45 36.42,14.86 36.42,13.56 arc90 37.21,12.77 LT3579_IC_2.5 39.16,12.77 arc45 38.3,12.41 38.07,12.18 arc45 v37.49,10.79 | 35.44,53.92 35.72,53.97 arc-23 36.22,54.07 v36.52,54.07 | v37.5,16.5 37.1,16.5 | 36.23,32.27 36.05,31.32 v35.95,31.22 | 34.51,16.5 37.1,16.5 | 35.44,50.97 35.44,50.31 arc45 v35.62,49.87 | L1L2_2.3 19.61,17.23 | 17.2,19.64 17.17,19.68 17.07,19.68
  Top 0.813: C_IN_1_.1 C_IN_2_.1 32.19,58.87
  Top 0.816: L1L2_1.3 19.39,39.7 | 19.39,39.7 24.5,39.7 arc-45 C_IN_1_1.1 C_IN_2_1.1 27.91,38.99 arc-45 29.68,38.26 TP_IN_1.1 30.87,38.26 arc-45 36.92,35.76 | 11.33,43.33 11.33,57.42 arc-90 14.19,60.27 22.04,60.27 arc-45 25.42,58.87 C_IN_1_.1 25.46,58.87 arc45 19.69,56.48 L1L2_.3 | 19.39,39.7 arc45 16.81,40.77 11.08,40.77 | 34.51,16.5 TP_IN_2.1 33.48,16.29 30.09,18.92 C_IN_1_2.1 29.7,19.02 C_IN_2_2.1 25.89,19.02 arc45 24.32,19.68 17.07,19.68 arc-45 13.62,21.1 11.96,22.76 | 19.61,17.23 17.2,19.64
  Route2 0.381: v35.95,31.22 32.42,31.17 arc-45 31.51,31.55 v31.09,31.97 | v37.49,10.79 34.53,10.79 33.79,10.87 arc-45 32.83,11.27 v32.22,11.87 | v30.39,50.57 arc-45 31.13,50.27 arc45 32.08,49.87 v35.62,49.87
  Bottom 0.381: v37.5,16.5 39.06,14.94 arc23 39.44,14.68 arc23 40.89,14.39 49.63,14.39 arc-45 50.77,13.92 51.24,13.45 R_UVLO1_2.2 | R_UVLO1_1.2 arc90 48.31,33.66 39.65,33.66 arc-22 38.11,34.69 37.03,35.77 v36.93,35.77 | v36.52,54.07 37.67,52.92 arc45 39.47,52.17 48.58,52.17 arc-45 50.36,51.44 50.4,51.4 R_UVLO1_.2 | v31.09,31.97 31.34,32.23 arc-22 32.82,32.53 R_FAULT_1.2 | v32.22,11.87 arc45 32.87,12.14 33.24,12.51 R_FAULT_2.2 | R_FAULT_.2 32.43,50.57 arc45 v30.39,50.57
  pour Top (no thermals): 7.26,40.87 6.76,40.37 arc45 6.35,39.39 6.35,22.63 arc90 6.91,22.07 11.41,22.07 arc90 12.99,23.66 12.99,42.62 arc90 11.2,44.41 8.29,44.41 arc90 7.77,43.89 7.77,42.1 arc-45
VIN_CONNECTOR  (via drill 0.81)
  other vias: 5.77,16.31 7.7,16.31 9.8,16.26 9.91,13.69 11.68,16.26 11.63,13.69 11.68,17.98 11.68,19.91
  pour Top (isolate 0.25, no thermals): 12.94,13.45 12.94,19.15 arc90 10.99,21.1 6.47,21.1 arc90 4.5,19.13 4.5,12.28 arc90 5.18,11.6 11.08,11.6 arc90
  pour Bottom (no thermals): 10.96,21.11 6.43,21.11 arc90 4.52,19.2 4.52,12.47 arc90 5.39,11.61 10.97,11.61 arc90 12.95,13.59 12.95,19.11 arc90
VOUT_  (via drill 0.35)
  Top 0.816: PMOS_.2 41.48,55.48 TP_OUT_.1 42.05,56.4 C_OUT_3_.1 C_OUT_2_.1 C_OUT_1_.1 50.94,56.4 arc-45 R_20K_LED1_.2 52.98,55.5 55.05,55.5 arc-45 56.47,54.91 arc-45 59.79,46.88 59.79,36.67 arc-45 v57.55,31.27
  Bottom 0.816: v57.55,31.27 58.22,31.94 12P_OUTPUT_CONNECTOR1.11
VOUT_1  (via drill 0.35)
  Top 0.816: PMOS_1.2 40.94,36.63 42.97,36.49 TP_OUT_1.1 44.35,36.5 47.02,36.68 C_OUT_1_1.1 C_OUT_2_1.1 C_OUT_3_1.1 52.64,36.7 R_LED_10K_1.1 52.88,36.74 v52.88,34.58
  Bottom 0.816: 12P_OUTPUT_CONNECTOR1.9 58.21,34.58 v52.88,34.58
VOUT_2  (via drill 0.35)
  Top 0.816: PMOS_2.2 arc-45 43.51,18.77 TP_OUT_2.1 arc45 46.82,17.94 C_OUT_3_2.1 51.67,17.94 C_OUT_2_2.1 54.43,17.96 C_OUT_1_2.1 54.66,18.19 R_LED_10K_2.1 56.98,20.22 arc45 56.59,21.17 56.59,35.19 arc-45 v56.82,35.75
  Bottom 0.816: 12P_OUTPUT_CONNECTOR1.7 58.21,35.88 arc-45 57.9,35.75 v56.82,35.75

## Text on the board
tNames: 14Vout | 6.5Vout | 5Vout | BAJA SAE 2021-2022 / Power Module / Designed By Jovany Zepeda